# Altium schematic sheet LittleBoard.SchDoc
size A
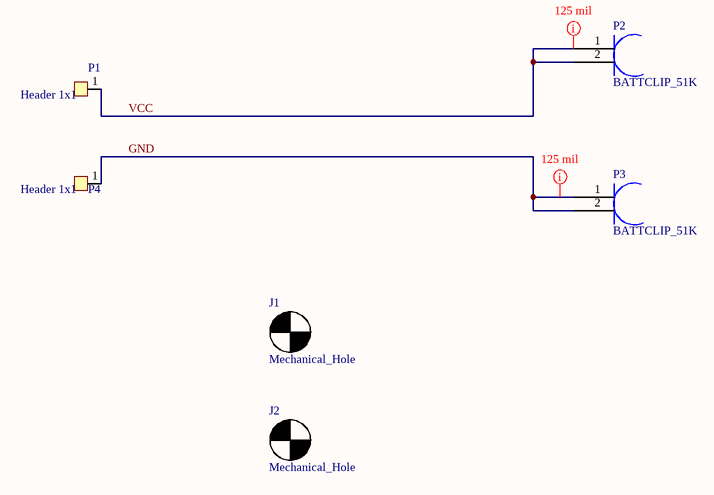
[diagram p0: LittleBoard.SchDoc]

## Parts
J1  Mechanical_Hole  [#4_Screw_Hole]
J2  Mechanical_Hole  [#4_Screw_Hole]
P1  Header 1x1  [HDR1X1]
P2  BATTCLIP_51K  [BATTCLIP_51K]
P3  BATTCLIP_51K  [BATTCLIP_51K]
P4  Header 1x1  [HDR1X1]

## Nets
GND: P3.1 P3.2 P4.1
VCC: P1.1 P2.1 P2.2

## Layout directives
rule Width Constraint [Pref Width = 125mil    Min Width = 50mil    Max Width = 200mil]: GND, VCC

## Library data of the parts
J1 J2 = Mechanical_Hole: A mechanical hole for mounting the board